# EAGLE design pi_gpio_ics_5pin (EAGLE 7.6.0)
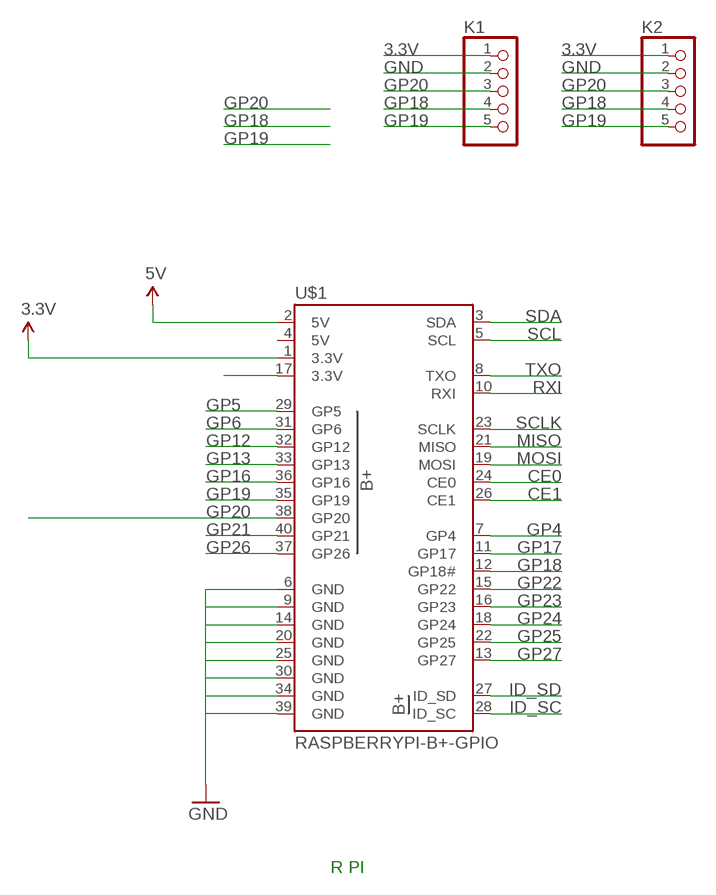
[diagram p0: schematic, sheet 1]

## Parts
K1  HEADER-1X5SMT  [1X05_SMT]
K2  HEADER-1X5SMT  [1X05_SMT]
U$1  RASPBERRYPI-B+-GPIO  [2X20-SHROUDED]

## Nets
3.3V: K1.1 K2.1 U$1.1(3.3V) U$1.17(3.3V)
5V: U$1.2(5V)
CE0: U$1.24(CE0)
CE1: U$1.26(CE1)
GND: K1.2 K2.2 U$1.6(GND) U$1.9(GND) U$1.14(GND) U$1.20(GND) U$1.25(GND) U$1.30(GND) U$1.34(GND) U$1.39(GND)
GP4: U$1.7(GP4)
GP5: U$1.29(GP5)
GP6: U$1.31(GP6)
GP12: U$1.32(GP12)
GP13: U$1.33(GP13)
GP16: U$1.36(GP16)
GP17: U$1.11(GP17)
GP18: K1.4 K2.4 U$1.12(GP18#)
GP19: K1.5 K2.5 U$1.35(GP19)
GP20: K1.3 K2.3 U$1.38(GP20)
GP21: U$1.40(GP21)
GP22: U$1.15(GP22)
GP23: U$1.16(GP23)
GP24: U$1.18(GP24)
GP25: U$1.22(GP25)
GP26: U$1.37(GP26)
GP27: U$1.13(GP27)
ID_SC: U$1.28(ID_SC)
ID_SD: U$1.27(ID_SD)
MISO: U$1.21(MISO)
MOSI: U$1.19(MOSI)
RXI: U$1.10(RXI)
SCL: U$1.5(SCL)
SCLK: U$1.23(SCLK)
SDA: U$1.3(SDA)
TXO: U$1.8(TXO)

## Notes on the sheet
- R PI

## Power pins joined to a net without a drawn wire
5V: U$1.4(5V)

## Library data of the parts
K1 K2 = twomey:HEADER-1X5: PIN HEADER
U$1 = SparkFun-Boards:RASPBERRYPI-B+-GPIO: Raspberry Pi B+ GPIO Header 2x20 pin connector

## Net classes
0 default: clearance 0.205 mm

## Board
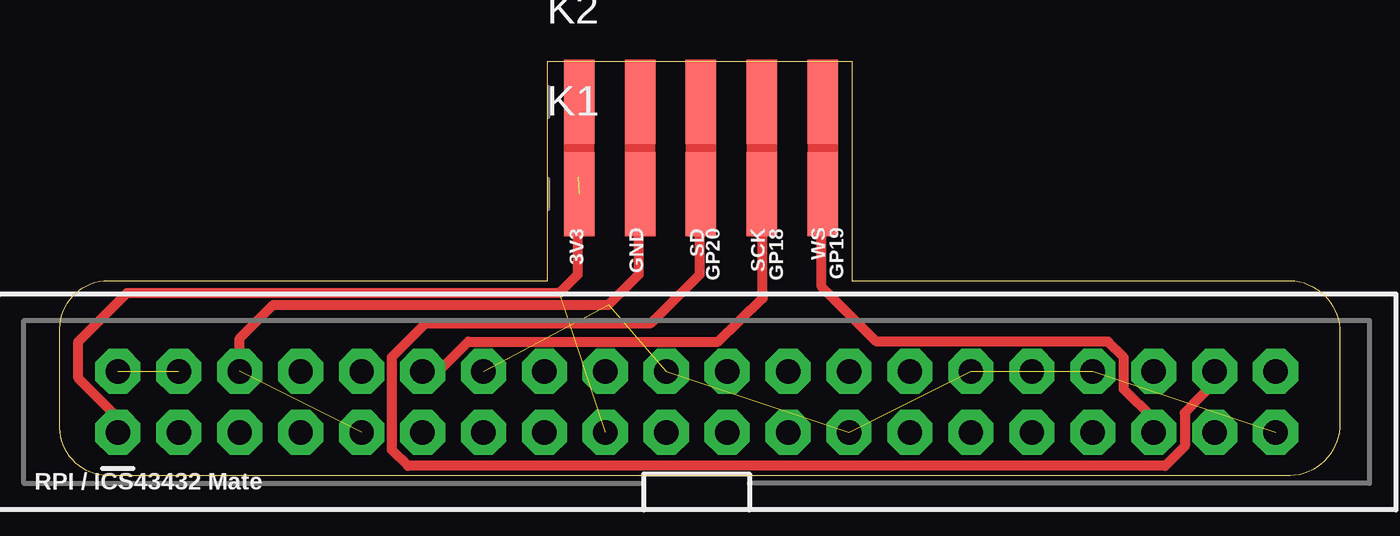
[diagram p1: board, top side]

Size 53.34 x 17.27 mm. Coordinates in mm from the lower left corner, seen from the top.
Outline: 33.02,8.13 51.09,8.13 arc-90 53.34,6.13 53.34,2 arc-90 51.09,0 2,0 arc-90 0,2 0,6.13 arc-90 2,8.13 20.32,8.13 20.32,17.27 33.02,17.27 33.02,8.13
Copper layers (1*16): Top 0.035mm / dielectric 1.5mm / Bottom 0.035mm
Design rules "default *": minimum track width 8mil, minimum drill 24mil, track to track 4mil, track to pad 4mil, pad to pad 8mil, via to via 8mil, smd to smd 8mil, copper to edge 12mil, drill to drill 8mil, minimum pad ring 10mil, minimum via ring 8mil, stop-mask expansion 4mil, vias tented up to drill 0mil, thermal gap 10mil

### Footprints (pad centres in the part's own frame; a part is rotated, then mirrored left to right if it is on the bottom)
1X05_SMT = smd 1.27 x 3.5: 1 -5.08,0; 2 -2.54,0; 3 0,0; 4 2.54,0; 5 5.08,0
2X20-SHROUDED = drill 1.016 pad 1.88 octagon: 1 -1.27,24.13; 2 1.27,24.13; 3 -1.27,21.59; 4 1.27,21.59; 5 -1.27,19.05; 6 1.27,19.05; 7 -1.27,16.51; 8 1.27,16.51; 9 -1.27,13.97; 10 1.27,13.97; 11 -1.27,11.43; 12 1.27,11.43; 13 -1.27,8.89; 14 1.27,8.89; 15 -1.27,6.35; 16 1.27,6.35; 17 -1.27,3.81; 18 1.27,3.81; 19 -1.27,1.27; 20 1.27,1.27; 21 -1.27,-1.27; 22 1.27,-1.27; 23 -1.27,-3.81; 24 1.27,-3.81; 25 -1.27,-6.35; 26 1.27,-6.35; 27 -1.27,-8.89; 28 1.27,-8.89; 29 -1.27,-11.43; 30 1.27,-11.43; 31 -1.27,-13.97; 32 1.27,-13.97; 33 -1.27,-16.51; 34 1.27,-16.51; 35 -1.27,-19.05; 36 1.27,-19.05; 37 -1.27,-21.59; 38 1.27,-21.59; 39 -1.27,-24.13; 40 1.27,-24.13

### Placement (x,y rotation side)
K1  26.72,11.74 0 top
K2  26.72,15.57 0 top
U$1  26.54,3.08 90 top

### Tracks (layer width: path | path; a pad name or v marks a point on that pad's centre or on a via)
3.3V  (2 unrouted)
  Top 0.406: U$1.1 2.41,2.42 0.76,4.07 0.76,5.59 2.79,7.62 20.83,7.62 21.59,8.38 21.59,12.45 | 21.59,16.03 K2.1
  Top 1.27: K1.1 K2.1
5V  (1 unrouted)
GND  (7 unrouted)
  Top 0.406: U$1.6 7.49,5.72 8.89,7.11 22.86,7.11 24.13,8.38 24.13,12.19 K1.2
  Top 1.27: K1.2 K2.2
GP18
  Top 0.406: U$1.12 15.77,4.35 17.02,5.59 27.43,5.59 29.29,7.39 29.29,11.81 K1.4
  Top 1.27: K1.4 K2.4
GP19
  Top 0.406: U$1.35 45.59,2.36 44.35,3.61 44.35,4.93 43.69,5.59 34.04,5.59 31.75,7.88 31.75,12.19 K1.5
  Top 1.27: K1.5 K2.5
GP20
  Top 0.406: U$1.38 48.13,3.91 46.89,2.62 46.89,1.22 46.08,0.41 14.5,0.41 13.84,1.07 13.84,4.96 15.24,6.35 24.64,6.35 26.67,8.38 26.67,12.19 K1.3
  Top 1.27: K1.3 K2.3

### Text on the board
tPlace: 3V3 | GND | SD | GP20 | SCK | GP18 | WS | GP19 | RPI / ICS43432 Mate